# EasyEDA Pro project Coilboard.epro

# Board PCB1
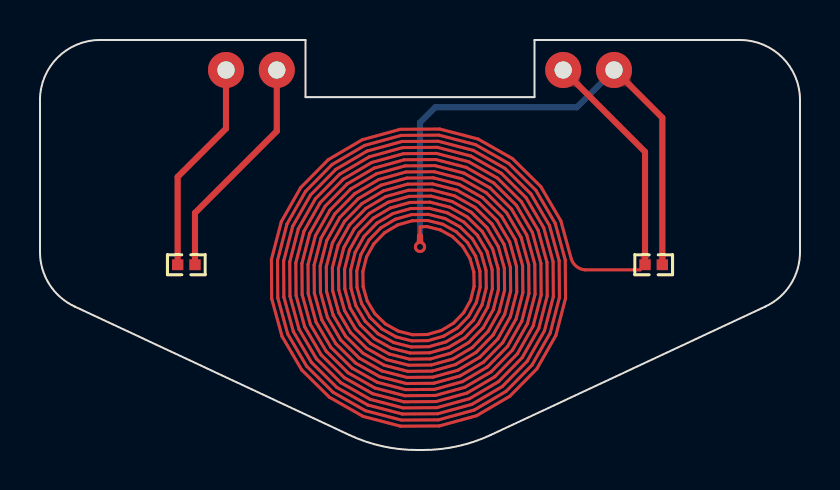
[diagram p0: board, top side]
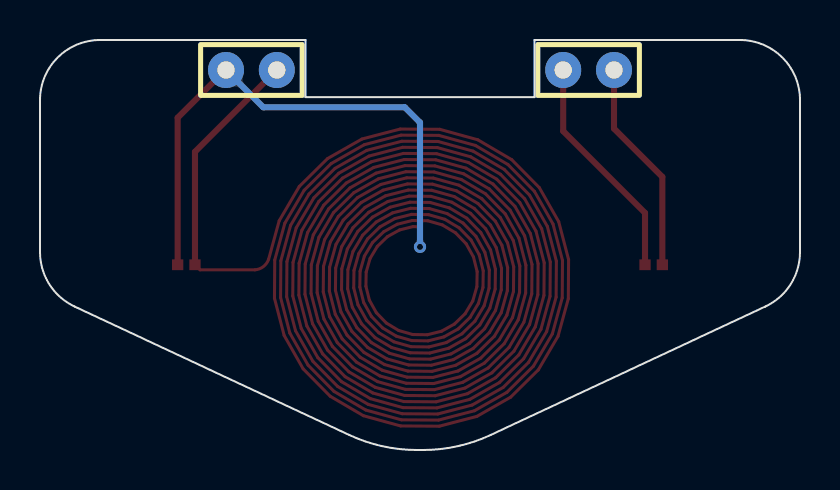
[diagram p1: board, bottom side, seen from below]

Outline 38 x 20.5 mm; copper layers: Top Layer, Bottom Layer. Coordinates in mm from the lower left corner of the outline.
Outline path: 0,17.5 0,9.9 arc(0.47,8.28) 1.73,7.17 15.46,0.75 arc(17.11,0.19) 18.85,0 19.15,0 arc(20.89,0.19) 22.54,0.75 36.27,7.17 arc(37.53,8.28) 38,9.9 38,17.5 arc(37.12,19.62) 35,20.5 24.72,20.5 24.72,17.64 13.28,17.64 13.28,20.5 3,20.5 arc(0.88,19.62) 0,17.5
Stack: Top Layer 0.035mm / Dielectric1 1.51mm FR4 er 4.5 / Bottom Layer 0.035mm

## Design rules (mm)
template: JLCPCB Capability(Two Layers Board)
spacing copperThickness1oz (default): track to track 0.102, other pairs 0.152 to 0.3
spacing copperThickness2oz: track to track 0.203, other pairs 0.152 to 0.3
track width copperThickness1oz (default): min 0.127, default 0.254, max 2.54
track width copperThickness2oz: min 0.203, default 0.254, max 2.54
differential pair differentialPair (default): width min 0.127, default 0.254, max 2.54; gap min 0.152, default 0.152
via viaSize (default): diameter min 0.5, default 0.61, max 10; hole min 0.3, default 0.305, max 6.3

## Placement (name value [footprint] x y rotation side)
C1  1nF  [C0402]  30.68 9.26 0 top
H1  826629-2  [HDR-TH_2P-P2.54-V-M-1]  10.57 19 180 bottom
H2  826629-2  [HDR-TH_2P-P2.54-V-M-1]  27.43 19 0 bottom
R1  SDNT1005X473F4050FTF  [R0402]  7.32 9.26 180 top

## Footprints (pads in the part's own frame, mm; a bottom-side part is the same pattern mirrored in y, then rotated)
C0402
  rect 0.566x0.54 smd: 1(-0.433,0) 2(0.433,0)
HDR-TH_2P-P2.54-V-M-1
  round 1.8 hole 0.864: 1(-1.27,0) 2(1.27,0)
R0402
  rect 0.566x0.54 smd: 1(-0.433,0) 2(0.433,0)

## Nets
$1N229: C1.1 C1.2 H2.1 H2.2
$1N289: H1.1 R1.1
$1N293: H1.2 R1.2

## Via types
v1: diameter 0.61, hole 0.305, Top Layer to Bottom Layer, 1 via

## Routing (per net, layer and track width the routed paths; a pad name or vN(x,y) marks a point on that pad's centre or on a via; arc(x,y) is an arc through that point)
$1N229: length 566.7
  Top Layer w0.152: C1.1 30,9.01 27.26,9.01 arc(26.83,9.17) 26.57,9.54 26.04,11.46 25.04,13.17 23.62,14.57 21.9,15.55 19.99,16.05 18.01,16.04 16.11,15.51 14.42,14.52 13.04,13.12 12.07,11.42 11.57,9.52 11.58,7.57 12.1,5.69 13.09,4 14.47,2.64 16.16,1.68 18.03,1.19 19.97,1.2 21.83,1.72 23.49,2.69 24.84,4.06 25.79,5.73 26.28,7.58 26.26,9.5 25.76,11.34 24.79,12.99 23.44,14.32 21.78,15.26 19.95,15.74 18.05,15.73 16.23,15.23 14.6,14.27 13.28,12.93 12.35,11.3 11.88,9.48 11.89,7.61 12.39,5.8 13.33,4.19 14.66,2.88 16.27,1.96 18.07,1.5 19.93,1.51 21.71,2 23.3,2.93 24.6,4.25 25.51,5.85 25.97,7.63 25.96,9.46 25.47,11.22 24.55,12.8 23.25,14.08 21.67,14.98 19.91,15.44 18.09,15.43 16.35,14.94 14.79,14.03 13.52,12.75 12.63,11.18 12.18,9.44 12.19,7.65 12.67,5.92 13.57,4.38 14.84,3.13 16.39,2.25 18.11,1.8 19.89,1.81 21.59,2.28 23.12,3.18 24.36,4.43 25.22,5.96 25.67,7.67 25.65,9.42 25.19,11.11 24.3,12.61 23.06,13.84 21.55,14.7 19.87,15.13 18.13,15.12 16.47,14.66 14.98,13.79 13.77,12.56 12.92,11.06 12.49,9.4 12.5,7.69 12.95,6.04 13.82,4.57 15.03,3.37 16.51,2.53 18.15,2.1 19.85,2.12 21.48,2.57 22.93,3.42 24.11,4.62 24.94,6.08 25.36,7.71 25.35,9.38 24.91,10.99 24.06,12.43 22.88,13.59 21.43,14.41 19.83,14.83 18.17,14.82 16.58,14.38 15.16,13.54 14.01,12.37 13.2,10.94 12.79,9.36 12.8,7.73 13.24,6.16 14.06,4.75 15.22,3.61 16.63,2.82 18.19,2.41 19.81,2.42 21.36,2.85 22.74,3.67 23.87,4.81 24.66,6.2 25.06,7.75 25.04,9.34 24.62,10.87 23.82,12.24 22.69,13.35 21.31,14.13 19.79,14.52 18.21,14.51 16.7,14.09 15.35,13.3 14.25,12.18 13.49,10.83 13.1,9.32 13.11,7.77 13.52,6.27 14.31,4.94 15.41,3.86 16.75,3.1 18.23,2.71 19.77,2.73 21.24,3.14 22.56,3.91 23.62,5 24.37,6.32 24.75,7.79 24.74,9.3 24.34,10.75 23.57,12.05 22.5,13.11 21.2,13.84 19.75,14.22 18.25,14.21 16.82,13.81 15.54,13.05 14.5,12 13.77,10.71 13.4,9.28 13.41,7.81 13.81,6.39 14.55,5.13 15.59,4.1 16.86,3.38 18.27,3.02 19.73,3.03 21.12,3.42 22.37,4.15 23.38,5.18 24.09,6.44 24.45,7.83 24.44,9.26 24.05,10.64 23.33,11.86 22.31,12.86 21.08,13.56 19.71,13.91 18.29,13.9 16.94,13.52 15.73,12.81 14.74,11.81 14.05,10.59 13.71,9.24 13.72,7.85 14.09,6.51 14.79,5.31 15.78,4.35 16.98,3.67 18.31,3.32 19.69,3.34 21,3.7 22.18,4.4 23.14,5.37 23.8,6.55 24.14,7.87 24.13,9.22 23.77,10.52 23.09,11.68 22.13,12.62 20.96,13.28 19.67,13.61 18.33,13.6 17.05,13.24 15.91,12.57 14.99,11.62 14.34,10.47 14.01,9.2 14.02,7.89 14.37,6.63 15.04,5.5 15.97,4.59 17.1,3.95 18.35,3.63 19.65,3.64 20.89,3.99 21.99,4.64 22.89,5.56 23.52,6.67 23.84,7.91 23.83,9.18 23.48,10.4 22.84,11.49 21.94,12.37 20.84,12.99 19.63,13.3 18.38,13.29 17.17,12.96 16.1,12.32 15.23,11.44 14.62,10.36 14.31,9.16 14.33,7.93 14.66,6.74 15.28,5.69 16.15,4.83 17.22,4.24 18.39,3.93 19.61,3.95 20.77,4.27 21.81,4.88 22.65,5.74 23.24,6.79 23.53,7.95 23.52,9.14 23.2,10.28 22.6,11.3 21.75,12.13 20.73,12.71 19.59,13 18.42,12.99 17.29,12.67 16.29,12.08 15.47,11.25 14.91,10.24 14.62,9.12 14.63,7.97 14.94,6.86 15.53,5.88 16.34,5.08 17.33,4.52 18.43,4.24 19.57,4.25 20.65,4.56 21.62,5.13 22.4,5.93 22.95,6.91 23.23,7.99 23.22,9.1 22.92,10.17 22.35,11.12 21.57,11.89 20.61,12.42 19.55,12.7 18.46,12.68 17.41,12.39 16.47,11.84 15.72,11.06 15.19,10.12 14.92,9.08 14.94,8.01 15.23,6.98 15.77,6.06 16.53,5.32 17.45,4.8 18.47,4.54 19.53,4.56 20.53,4.84 21.43,5.37 22.16,6.12 22.67,7.02 22.92,8.03 22.91,9.06 22.63,10.05 22.11,10.93 21.38,11.64 20.49,12.14 19.51,12.39 18.5,12.38 17.52,12.1 16.66,11.59 15.96,10.87 15.47,10 15.23,9.04 15.24,8.05 15.51,7.1 16.01,6.25 16.72,5.57 17.57,5.09 18.51,4.85 19.49,4.86 20.42,5.12 21.25,5.62 21.92,6.31 22.38,7.14 22.62,8.07 22.61,9.02 22.35,9.93 21.87,10.74 21.19,11.4 20.37,11.86 19.47,12.09 18.54,12.07 17.64,11.82 16.85,11.35 16.21,10.69 15.76,9.89 15.53,9 15.55,8.09 15.79,7.21 16.26,6.44 16.9,5.81 17.69,5.37 18.55,5.15 19.44,5.17 20.3,5.41 21.06,5.86 21.67,6.49 22.1,7.26 22.31,8.11 22.3,8.98 22.06,9.81 21.62,10.55 21,11.15 20.25,11.57 19.43,11.78 18.58,11.77 17.76,11.54 17.04,11.1 16.45,10.5 16.04,9.77 15.84,8.96 15.85,8.13 16.08,7.33 16.5,6.63 17.09,6.05 17.8,5.66 18.59,5.46 19.4,5.47 20.18,5.69 20.87,6.1 21.43,6.68 21.82,7.38 22.01,8.15 22,8.94 21.78,9.69 21.38,10.37 20.82,10.91 20.14,11.29 19.39,11.48 18.62,11.46 17.88,11.25 17.22,10.86 16.69,10.31 16.33,9.65 16.14,8.92 16.16,8.17 16.36,7.45 16.74,6.81 17.28,6.3 17.92,5.94 18.63,5.76 19.36,5.77 20.06,5.98 20.68,6.35 21.18,6.87 21.53,7.49 21.7,8.19 21.69,8.9 21.5,9.58 21.13,10.18 20.63,10.67 20.02,11 19.35,11.17 19,11.16 19,10.71
  Top Layer w0.305: 19,10.71 19,10.26 ; 26.15,19.02 H2.1 30.25,14.91 C1.1 ; 28.7,19.03 31.12,16.61 C1.2
  Bottom Layer w0.305: H2.2 26.84,17.14 19.76,17.14 19,16.37 v1(19,10.15)
$1N289: length 11.4
  Top Layer w0.305: H1.1 11.84,15.94 7.75,11.85 R1.1
$1N293: length 10.8
  Top Layer w0.305: 9.3,19.03 9.3,16.07 6.88,13.65 R1.2

Small or netless copper shapes (teardrops, artwork), in the pictures only: 6 on Top Layer, 2 on Bottom Layer
